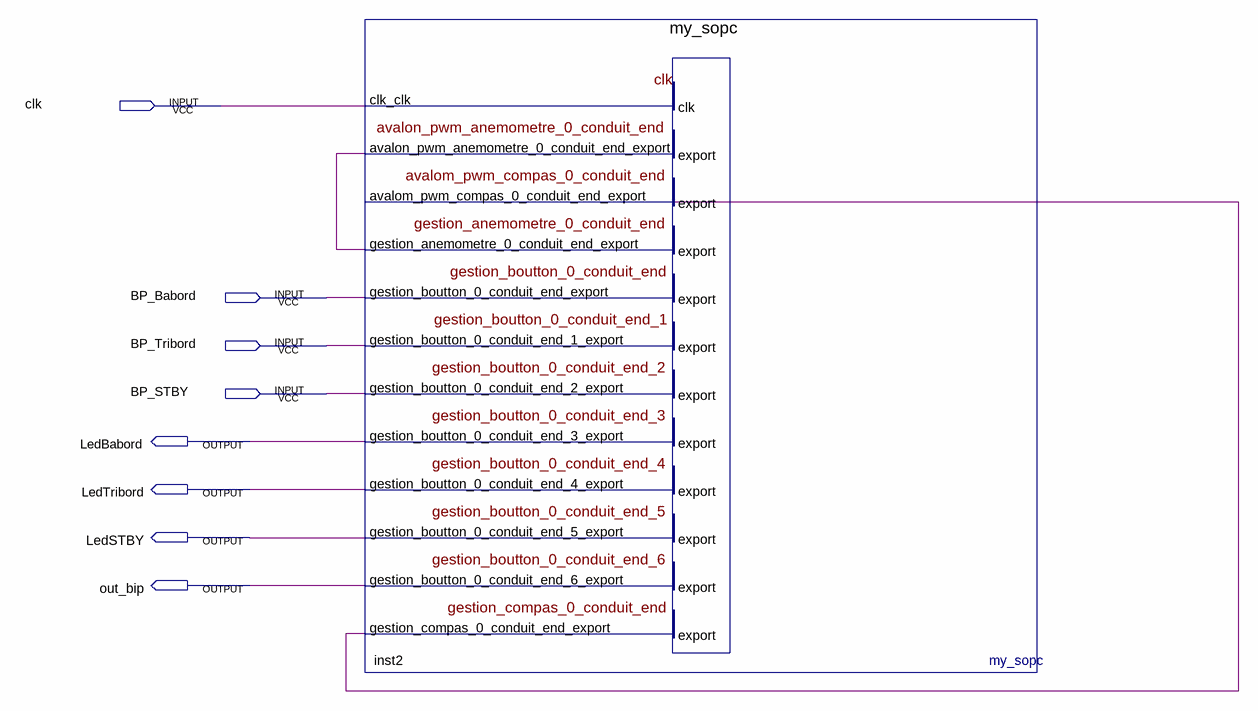
[diagram p0: schematic sheet]
// Quartus schematic barre_franche.bdf as structural Verilog: 1 symbols, 8 pins
module barre_franche (
  input  clk,
  input  BP_Babord,
  input  BP_Tribord,
  input  BP_STBY,
  output LedBabord,
  output LedTribord,
  output LedSTBY,
  output out_bip
);

  wire inst2_avalom_pwm_compas_0_conduit_end_export, inst2_avalon_pwm_anemometre_0_conduit_end_export;

  my_sopc inst2 (
    .clk_clk(clk),
    .gestion_anemometre_0_conduit_end_export(inst2_avalon_pwm_anemometre_0_conduit_end_export),
    .gestion_boutton_0_conduit_end_export(BP_Babord), .gestion_boutton_0_conduit_end_1_export(BP_Tribord),
    .gestion_boutton_0_conduit_end_2_export(BP_STBY),
    .gestion_compas_0_conduit_end_export(inst2_avalom_pwm_compas_0_conduit_end_export),
    .avalon_pwm_anemometre_0_conduit_end_export(inst2_avalon_pwm_anemometre_0_conduit_end_export),
    .avalom_pwm_compas_0_conduit_end_export(inst2_avalom_pwm_compas_0_conduit_end_export),
    .gestion_boutton_0_conduit_end_3_export(LedBabord), .gestion_boutton_0_conduit_end_4_export(LedTribord),
    .gestion_boutton_0_conduit_end_5_export(LedSTBY), .gestion_boutton_0_conduit_end_6_export(out_bip));
endmodule
